# Altium schematic sheet Cart.SchDoc
size A4
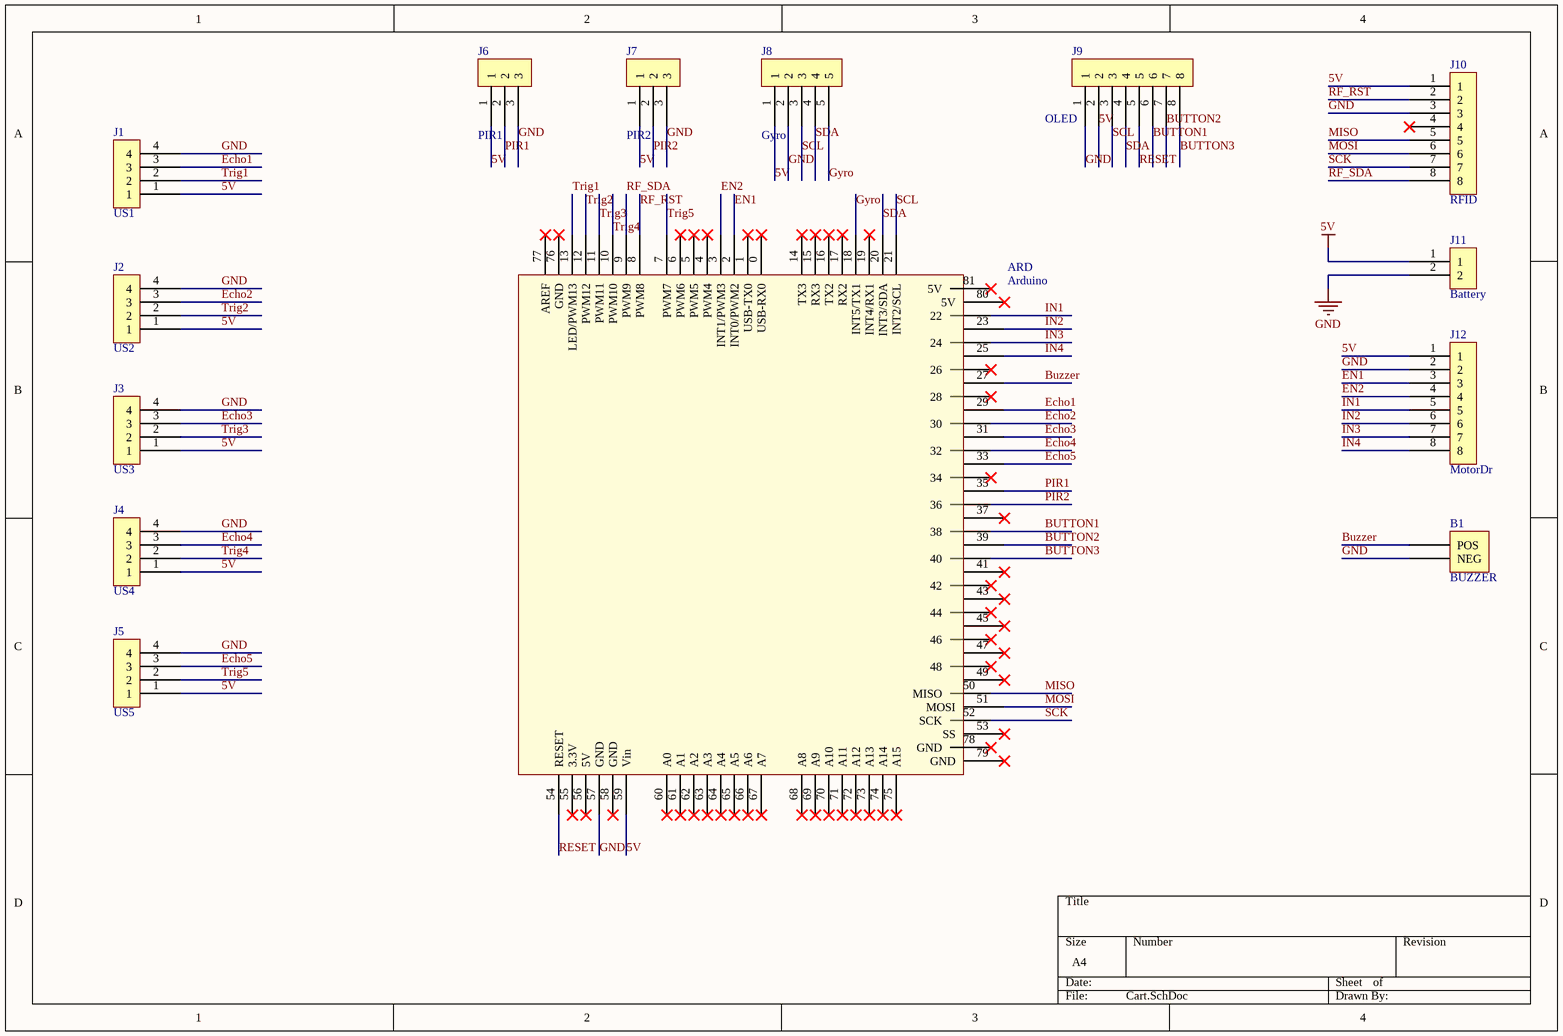
[diagram p0: Cart.SchDoc]

## Parts
ARD  Arduino  [Arduino]
B1  BUZZER  [new buzzer]
J1  US1  [JST4]
J2  US2  [JST4]
J3  US3  [JST4]
J4  US4  [JST4]
J5  US5  [JST4]
J6  PIR1  [JST3]
J7  PIR2  [JST3]
J8  Gyro  [JST5]
J9  OLED  [JST8]
J10  RFID  [JST8]
J11  Battery  [JST2]
J12  MotorDr  [JST8]

## Nets
5V: ARD.59(Vin) J1.1 J2.1 J3.1 J4.1 J5.1 J6.1 J7.1 J8.1 J9.2 J10.1 J11.1 J12.1
GND: ARD.57(GND) B1.2(NEG) J1.4 J2.4 J3.4 J4.4 J5.4 J6.3 J7.3 J8.2 J9.1 J10.3 J11.2 J12.2
BUTTON1: ARD.38 J9.6
BUTTON2: ARD.39 J9.7
BUTTON3: ARD.40 J9.8
Buzzer: ARD.27 B1.1(POS)
Echo1: ARD.29 J1.3
Echo2: ARD.30 J2.3
Echo3: ARD.31 J3.3
Echo4: ARD.32 J4.3
Echo5: ARD.33 J5.3
EN1: ARD.2(INT0/PWM2) J12.3
EN2: ARD.3(INT1/PWM3) J12.4
Gyro: ARD.18(INT5/TX1) J8.5
IN1: ARD.22 J12.5
IN2: ARD.23 J12.6
IN3: ARD.24 J12.7
IN4: ARD.25 J12.8
MISO: ARD.50(MISO) J10.5
MOSI: ARD.51(MOSI) J10.6
PIR1: ARD.35 J6.2
PIR2: ARD.36 J7.2
RESET: ARD.54(RESET) J9.5
RF_RST: ARD.8(PWM8) J10.2
RF_SDA: ARD.9(PWM9) J10.8
SCK: ARD.52(SCK) J10.7
SCL: ARD.21(INT2/SCL) J8.3 J9.3
SDA: ARD.20(INT3/SDA) J8.4 J9.4
Trig1: ARD.13(LED/PWM13) J1.2
Trig2: ARD.12(PWM12) J2.2
Trig3: ARD.11(PWM11) J3.2
Trig4: ARD.10(PWM10) J4.2
Trig5: ARD.7(PWM7) J5.2

Not connected (* = marked no-connect by the designer): ARD 0(USB-RX0)* 1(USB-TX0)* 4(PWM4)* 5(PWM5)* 6(PWM6)* 14(TX3)* 15(RX3)* 16(TX2)* 17(RX2)* 19(INT4/RX1)* 26* 28* 34* 37* 41* 42* 43* 44* 45* 46* 47* 48* 49* 53(SS)* 55(3.3V)* 56(5V)* 58(GND)* 60(A0)* 61(A1)* 62(A2)* 63(A3)* 64(A4)* 65(A5)* 66(A6)* 67(A7)* 68(A8)* 69(A9)* 70(A10)* 71(A11)* 72(A12)* 73(A13)* 74(A14)* 75(A15)* 76(GND)* 77(AREF)* 78(GND)* 79(GND)* 80(5V)* 81(5V)*; J10 4*

## Library data of the parts
B1 = BUZZER: JST (JAPAN SOLDERLESS TERMINALS) - B8B-XH-A (LF)(SN) - HEADER, VERTICAL, 8WAY; No of Positions: 8; Pitch: 2.5 mm; Style/Orientation: Straight Header/Plug; Supplier 1: Digi-Key; Manufacturer: JST; Manufacturer Part Number: B8B-XH-A(LF)(SN); Stock 1: 29643; Pricing 1: 1=0.36, 10=0.341, 100=0.2387, 500=0.2046, 1000=0.1705, 5000=0.1461, 10000=0.1364 (USD); Type: Shrouded Header; Termination: Crimp; ComponentLink1URL: https://www.verical.com/server-webapp/html/getDatasheet?partID=440408&src-supplier=Verical; ComponentLink1Description: https://www.verical.com/server-webapp/html/getDatasheet?partID=440408&src-supplier=Verical; Supplier Part Number 1: 455-2251-ND
J1-J5 = JST 4 PIN: JST (JAPAN SOLDERLESS TERMINALS) - B8B-XH-A (LF)(SN) - HEADER, VERTICAL, 8WAY; No of Positions: 8; Pitch: 2.5 mm; Style/Orientation: Straight Header/Plug; Supplier 1: Digi-Key; Manufacturer: JST; Manufacturer Part Number: B8B-XH-A(LF)(SN); Stock 1: 29643; Pricing 1: 1=0.36, 10=0.341, 100=0.2387, 500=0.2046, 1000=0.1705, 5000=0.1461, 10000=0.1364 (USD); Type: Shrouded Header; Termination: Crimp; ComponentLink1URL: https://www.verical.com/server-webapp/html/getDatasheet?partID=440408&src-supplier=Verical; ComponentLink1Description: https://www.verical.com/server-webapp/html/getDatasheet?partID=440408&src-supplier=Verical; Supplier Part Number 1: 455-2251-ND
J6 J7 = JST 3 PIN: JST (JAPAN SOLDERLESS TERMINALS) - B8B-XH-A (LF)(SN) - HEADER, VERTICAL, 8WAY; No of Positions: 8; Pitch: 2.5 mm; Style/Orientation: Straight Header/Plug; Supplier 1: Digi-Key; Manufacturer: JST; Manufacturer Part Number: B8B-XH-A(LF)(SN); Stock 1: 29643; Pricing 1: 1=0.36, 10=0.341, 100=0.2387, 500=0.2046, 1000=0.1705, 5000=0.1461, 10000=0.1364 (USD); Type: Shrouded Header; Termination: Crimp; ComponentLink1URL: https://www.verical.com/server-webapp/html/getDatasheet?partID=440408&src-supplier=Verical; ComponentLink1Description: https://www.verical.com/server-webapp/html/getDatasheet?partID=440408&src-supplier=Verical; Supplier Part Number 1: 455-2251-ND
J8 = JST 5 PIN: JST (JAPAN SOLDERLESS TERMINALS) - B8B-XH-A (LF)(SN) - HEADER, VERTICAL, 8WAY; No of Positions: 8; Pitch: 2.5 mm; Style/Orientation: Straight Header/Plug; Supplier 1: Digi-Key; Manufacturer: JST; Manufacturer Part Number: B8B-XH-A(LF)(SN); Stock 1: 29643; Pricing 1: 1=0.36, 10=0.341, 100=0.2387, 500=0.2046, 1000=0.1705, 5000=0.1461, 10000=0.1364 (USD); Type: Shrouded Header; Termination: Crimp; ComponentLink1URL: https://www.verical.com/server-webapp/html/getDatasheet?partID=440408&src-supplier=Verical; ComponentLink1Description: https://www.verical.com/server-webapp/html/getDatasheet?partID=440408&src-supplier=Verical; Supplier Part Number 1: 455-2251-ND
J9 J10 J12 = JST 8 PIN: JST (JAPAN SOLDERLESS TERMINALS) - B8B-XH-A (LF)(SN) - HEADER, VERTICAL, 8WAY; No of Positions: 8; Pitch: 2.5 mm; Style/Orientation: Straight Header/Plug; Supplier 1: Digi-Key; Manufacturer: JST; Manufacturer Part Number: B8B-XH-A(LF)(SN); Stock 1: 29643; Pricing 1: 1=0.36, 10=0.341, 100=0.2387, 500=0.2046, 1000=0.1705, 5000=0.1461, 10000=0.1364 (USD); Type: Shrouded Header; Termination: Crimp; ComponentLink1URL: https://www.verical.com/server-webapp/html/getDatasheet?partID=440408&src-supplier=Verical; ComponentLink1Description: https://www.verical.com/server-webapp/html/getDatasheet?partID=440408&src-supplier=Verical; Supplier Part Number 1: 455-2251-ND
J11 = JST 2 PIN: JST (JAPAN SOLDERLESS TERMINALS) - B8B-XH-A (LF)(SN) - HEADER, VERTICAL, 8WAY; No of Positions: 8; Pitch: 2.5 mm; Style/Orientation: Straight Header/Plug; Supplier 1: Digi-Key; Manufacturer: JST; Manufacturer Part Number: B8B-XH-A(LF)(SN); Stock 1: 29643; Pricing 1: 1=0.36, 10=0.341, 100=0.2387, 500=0.2046, 1000=0.1705, 5000=0.1461, 10000=0.1364 (USD); Type: Shrouded Header; Termination: Crimp; ComponentLink1URL: https://www.verical.com/server-webapp/html/getDatasheet?partID=440408&src-supplier=Verical; ComponentLink1Description: https://www.verical.com/server-webapp/html/getDatasheet?partID=440408&src-supplier=Verical; Supplier Part Number 1: 455-2251-ND